# Altium schematic sheet PowerSupply.SchDoc
size A3; Organization: MCI; SheetNumber: 1; SheetTotal: 1
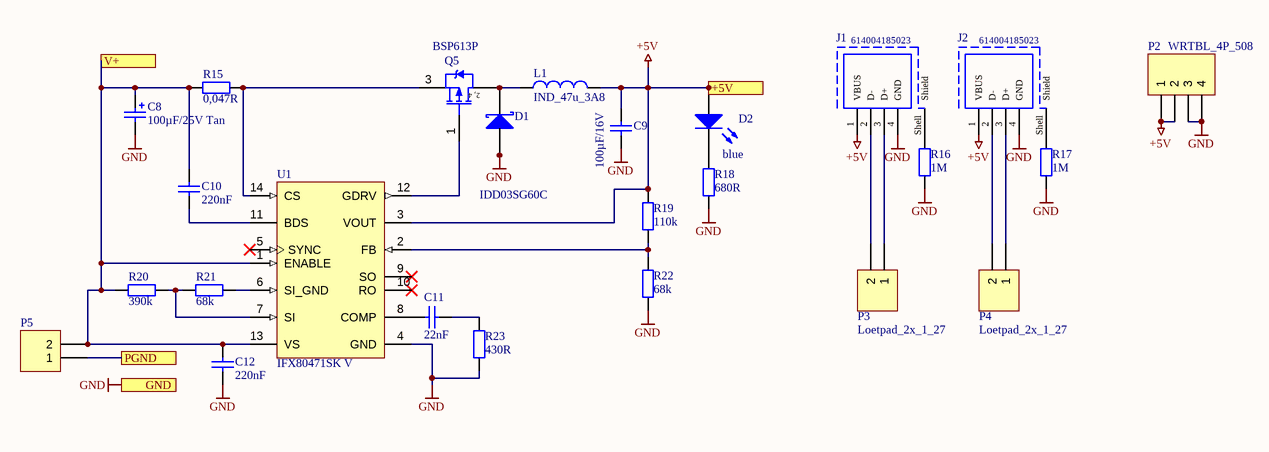
[diagram p0: PowerSupply.SchDoc]

## Parts
C8  100µF/25V Tan  [C]
C9  100µF/16V  [_1210]
C10  220nF  [_0805]
C11  22nF  [_0603]
C12  220nF  [_0805]
D1  IDD03SG60C  [TO_252]
D2  blue  [LED_0603]
J1  614004185023  [614004185023]
J2  614004185023  [614004185023]
L1  IND_47u_3A8  [WE_PD_XXL]
P2  WRTBL_4P_508  [WRTBL_4P_508]
P3  Loetpad_2x_1_27  [Loetpad_2x_1_27]
P4  Loetpad_2x_1_27  [Loetpad_2x_1_27]
P5  WRTBL_2P_508  [WRTBL_2P_508]  (value not drawn)
Q5  BSP613P  [INF-PG-SOT223_SC-73_N]
R15  0,047R  [_1206]
R16  1M  [_0603]
R17  1M  [_0603]
R18  680R  [_0603]
R19  110k  [_0603]
R20  390k  [_0603]
R21  68k  [_0603]
R22  68k  [_0603]
R23  430R  [_0603]
U1  IFX80471SK V  [INF-PG-DSO-14-1_N]

## Ports
+5V, GND, PGND, V+

## Nets
+5V: C9.2 D2.1 J1.1(VBUS) J2.1(VBUS) L1.2 P2.1 P2.2 R19.2 U1.3(VOUT) ; port +5V
GND: C8.2 C9.1 C12.1 D1.1 D1.2 J1.4(GND) J2.4(GND) P2.3 P2.4 R16.1 R17.1 R18.1 R22.1 R23.2 U1.4(GND) ; port GND
PGND: P5.1 ; port PGND
V+: C8.1 C10.2 C12.2 P5.2 R15.1 R20.1 U1.1(ENABLE) U1.13(VS) ; port V+
NetC10_1: C10.1 U1.11(BDS)
NetC11_1: C11.1 U1.8(COMP)
NetC11_2: C11.2 R23.1
NetD1_3: D1.3 L1.1 Q5.2(DRAIN) Q5.4(DRAIN)
NetD2_2: D2.2 R18.2
NetJ1_2: J1.2(D-) P3.2
NetJ1_3: J1.3(D+) P3.1
NetJ1_Shell: J1.Shell(Shield) R16.2
NetJ2_2: J2.2(D-) P4.2
NetJ2_3: J2.3(D+) P4.1
NetJ2_Shell: J2.Shell(Shield) R17.2
NetQ5_1: Q5.1(GATE) U1.12(GDRV)
NetQ5_3: Q5.3(SOURCE) R15.2 U1.14(CS)
NetR19_1: R19.1 R22.2 U1.2(FB)
NetR20_2: R20.2 R21.1 U1.7(SI)
NetR21_2: R21.2 U1.6(SI_GND)

Not connected (* = marked no-connect by the designer): U1 5(SYNC)* 9(SO)* 10(RO)*

## Notes on the sheet
- Project
- Date:
- Drawn by:
- Time:
- Number:
- Revision:
- Sheet
- of
- ELECTRONICS
- File:
- (in symbol Tran_33) 2, 4

## Library data of the parts
C8 = Cap_56: Name: Cap_tan_47u_25V; RS_number: 684-5284P; QR: 1; Capacity: 47u; Voltage: 25v; UID: Cap_56; Name_Hyperlink: Capacitor Tantalum SMT TR3D 25V 47uF; mounting: SMD
C9 = Cap_65: Name: Cap_1210; Capacity: ?F; Voltage: ?V; UID: Cap_65; mounting: SMD
C10 C12 = Cap_63: Name: Cap_0805; Capacity: ?F; Voltage: ?V; UID: Cap_63; mounting: SMD
C11 = Cap_129: Name: Cap_0603; QR: 0; UID: Cap_129; mounting: SMD
D1 = DIODE_12: Type: Schottky; Current / Power: 3.5 A; RS_number: 300-357P; QR: 0; UID: DIODE_12; Name: 30WQ06FN; Name_Hyperlink: Diode 30WQ06FN; mounting: SMD
D2 = DIODE_60: Name: LED_0603_blau; Colour: blau; RS_number: 697-3610P; QR: 0; UID: DIODE_60; Type: LED; Name_Hyperlink: http://at.rs-online.com/web/p/products/6973610P/; mounting: SMD
J1 J2 = 614004185023: USB 2.0 Type A Receptacle WR-COM, Vertical, THT, Short Type; Rated Current: 1.5 A; Contact Resistance: 30 mOhm; Working Voltage: 30 VAC; ComponentLink1Description: Manufacturer; ComponentLink1URL: http://www.we-online.de; ComponentLink2Description: Datasheet; ComponentLink2URL: https://katalog.we-online.de/em/datasheet/614004185023.pdf; Part Number: 614004185023; Published Date: September 2018; Publisher: Wurth Elektronik; Orientation: Vertical; Connector Type: USB 2.0 Type A; Operating Temperature: -55 to 85 degC; Mounting Technology: THT; Gender: Receptacle; Packaging: Tray
L1 = Ind_8: Inductor; Wuerth_number: 744 7709 470; QR: 0; Inductivity: 47 uH; Current: 3.8 A; UID: Ind_8; Name: IND_47u_3A8; mounting: SMD
P2 = Con_9: QR: 0; UID: Con_9; Name: WRTBL_4P_508; mounting: THT; Pins: 4
P3 P4 = Con_77: UID: Con_77; Name: Loetpad_2x_1_27; mounting: THT
P5 = Con_7: RS_number: 193-0586; QR: 0; UID: Con_7; Name: WRTBL_2P_508; Name_Hyperlink: Printklemme 5,08mm 2-polig; ComponentLink1URL: http://at.rs-online.com/web/search/searchBrowseAction.html?method=getProduct&R=1930586; mounting: THT; Pins: 2
Q5 = Tran_33: P-Channel SIPMOS Small-Signal-Transistor, -60 V VDS, -2.9 A ID, -55 to 150 degC, PG-SOT223 (SC-73), Reel, Green; Manufacturer: Infineon; Green: TRUE; ID (max): -2.9 A; IDpuls (max): -11.6 A; Mode: Enhancement; Polarity: P; Pto t (max): 1.8 W; QG: -22 nC; RDS (on) (max): 130 mOhm; Rth: 100 K/W; VDS (max): -60 V; VGS(th) (max): -4 V; VGS(th) (min): -2.1 V; DatasheetVersion: Rev. 2.7; PackageVersion: Apr-08; PackageReference: PG-SOT223 (SC-73); PackageDescription: 4-Pin Small Outline Transistor Package, 6.5 x 3.5 mm Body, 2.3 mm Pitch; Supplier 1: Digi-Key; Supplier Part Number 1: BSP613P-ND; Halogen-free: TRUE; Packing: Reel; Technology: SIPMOS; Mounting Technology: Surface Mount; PartNumber: BSP613P; ComponentLink1Description: Manufacturer URL; ComponentLink1URL: http://www.infineon.com/; ComponentLink2Description: Datasheet; ComponentLink2URL: http://www.infineon.com/dgdl/BSP613P_Rev2.7.pdf?folderId=db3a304314dca38901154a72e3951a65&fileId=db3a30433b47825b013b60ac86a96dc0; ComponentLink3Description: Package Specification; ComponentLink3URL: http://www.infineon.com/dgdl/SOT223-Package_Overview.pdf?folderId=db3a30431936bc4b0119530470b03c3d&fileId=db3a30431936bc4b0119531d40b93c5c; UID: Tran_33; Name: BSP613P; mounting: SMD; Type: P
R15 = Res_7: Name: Res_1206; UID: Res_7; mounting: SMD
R16-R23 = Res_5: Name: Res_0603; UID: Res_5; mounting: SMD
U1 = IFX80471SK V: Step-Down DC/DC Controller, 2,300 mA Iq, -40 to 125 degC, PG-DSO-14-1, Reel, Green; Manufacturer: Infineon; Green: TRUE; Iq (typ): 130 uA; Max Number Reflow: 3; Max Peak Reflow Temp: 260 degC; Output: Buck Converter; Tolerance: 3(5)%; VQ (max): adjustable; DatasheetVersion: Rev. 1.0; PackageVersion: Apr-11; PackageReference: PG-DSO-14-1; PackageDescription: 14-Pin Plastic (Green) Dual Small Outline Package, 8.65 x 3.9 mm Body, 1.27 mm Pitch; Supplier 1: Digi-Key; Supplier Part Number 1: IFX80471SK VINTR-ND; Supplier 2: Digi-Key; Supplier Part Number 2: IFX80471SK VINCT-ND; Supplier 3: Digi-Key; Supplier Part Number 3: IFX80471SK VINDKR-ND; Supplier 4: Mouser; Supplier Part Number 4: 726-IFX80471SKV; Halogen-free: TRUE; Inhibit: TRUE; IQ (max): 2,300 mA; MSL: 3; Packing: Reel; Protect: TRUE; Reset: TRUE; Mounting Technology: Surface Mount; PartNumber: IFX80471SK V; ComponentLink1Description: Manufacturer URL; ComponentLink1URL: http://www.infineon.com/; ComponentLink2Description: Datasheet; ComponentLink2URL: http://www.infineon.com/dgdl/DCDC-Controller-IFX80471-Data-Sheet-V10-Infineon.pdf?folderId=db3a304314dca3890115039cf70d0bf0&fileId=db3a30432e398416012e487ec6e42599; ComponentLink3Description: Package Specification; ComponentLink3URL: http://www.infineon.com/dgdl/DCDC-Controller-IFX80471-Data-Sheet-V10-Infineon.pdf?folderId=db3a304314dca3890115039cf70d0bf0&fileId=db3a30432e398416012e487ec6e42599